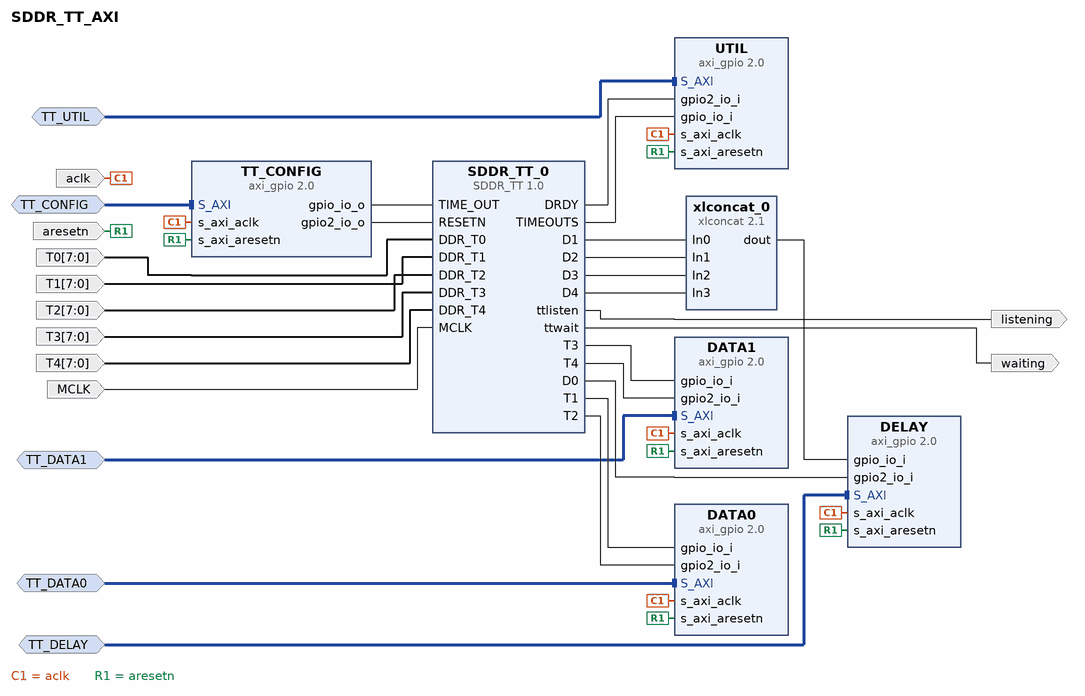
[diagram p0: block diagram of the top level]
# Vivado block design SDDR_TT_AXI, xc7z020clg400-1, Vivado 2019.1
create_bd_design SDDR_TT_AXI

create_bd_intf_port -mode Slave -vlnv xilinx.com:interface:aximm_tlm:1.0 TT_CONFIG
create_bd_intf_port -mode Slave -vlnv xilinx.com:interface:aximm_tlm:1.0 TT_DATA0
create_bd_intf_port -mode Slave -vlnv xilinx.com:interface:aximm_tlm:1.0 TT_DATA1
create_bd_intf_port -mode Slave -vlnv xilinx.com:interface:aximm_tlm:1.0 TT_DELAY
create_bd_intf_port -mode Slave -vlnv xilinx.com:interface:aximm_tlm:1.0 TT_UTIL
create_bd_port -dir I -from 7 -to 0 T0
create_bd_port -dir I -from 7 -to 0 T1
create_bd_port -dir I -from 7 -to 0 T2
create_bd_port -dir I -from 7 -to 0 T3
create_bd_port -dir I -from 7 -to 0 T4
create_bd_port -dir O waiting
create_bd_port -dir O listening
create_bd_port -dir I -type clk aclk
set_property -dict {CONFIG.FREQ_HZ 100000000} [get_bd_ports aclk]
create_bd_port -dir I -type rst aresetn
create_bd_port -dir I -type clk MCLK
set_property -dict {CONFIG.FREQ_HZ 400000000} [get_bd_ports MCLK]

create_bd_cell -type ip -vlnv xilinx.com:ip:axi_gpio:2.0 DATA0
set_property -dict {CONFIG.C_ALL_INPUTS 1 CONFIG.C_ALL_INPUTS_2 1 CONFIG.C_IS_DUAL 1} [get_bd_cells DATA0]
create_bd_cell -type ip -vlnv xilinx.com:ip:axi_gpio:2.0 DATA1
set_property -dict {CONFIG.C_ALL_INPUTS 1 CONFIG.C_ALL_INPUTS_2 1 CONFIG.C_IS_DUAL 1} [get_bd_cells DATA1]
create_bd_cell -type ip -vlnv xilinx.com:ip:axi_gpio:2.0 DELAY
set_property -dict {CONFIG.C_ALL_INPUTS 1 CONFIG.C_ALL_INPUTS_2 1 CONFIG.C_GPIO2_WIDTH 8 CONFIG.C_IS_DUAL 1} [get_bd_cells DELAY]
create_bd_cell -type ip -vlnv xilinx.com:ip:xlconcat:2.1 xlconcat_0
set_property -dict {CONFIG.NUM_PORTS 4} [get_bd_cells xlconcat_0]
create_bd_cell -type ip -vlnv xilinx.com:ip:axi_gpio:2.0 TT_CONFIG
set_property -dict [list \
  CONFIG.C_ALL_OUTPUTS 1 \
  CONFIG.C_ALL_OUTPUTS_2 1 \
  CONFIG.C_GPIO2_WIDTH 1 \
  CONFIG.C_IS_DUAL 1 \
] [get_bd_cells TT_CONFIG]
create_bd_cell -type ip -vlnv xilinx.com:ip:axi_gpio:2.0 UTIL
set_property -dict [list \
  CONFIG.C_ALL_INPUTS 1 \
  CONFIG.C_ALL_INPUTS_2 1 \
  CONFIG.C_GPIO2_WIDTH 1 \
  CONFIG.C_GPIO_WIDTH 4 \
  CONFIG.C_IS_DUAL 1 \
] [get_bd_cells UTIL]
create_bd_cell -type ip -vlnv cri.nz:user:SDDR_TT:1.0 SDDR_TT_0
set_property -dict {CONFIG.SIG_WIDTH 8} [get_bd_cells SDDR_TT_0]

# ---- connections ----

connect_bd_intf_net [get_bd_intf_ports TT_CONFIG] [get_bd_intf_pins TT_CONFIG/S_AXI]
connect_bd_intf_net [get_bd_intf_ports TT_UTIL] [get_bd_intf_pins UTIL/S_AXI]
connect_bd_intf_net -intf_net TT_DATA0_1 [get_bd_intf_ports TT_DATA0] [get_bd_intf_pins DATA0/S_AXI]
connect_bd_intf_net -intf_net TT_DATA1_1 [get_bd_intf_ports TT_DATA1] [get_bd_intf_pins DATA1/S_AXI]
connect_bd_intf_net [get_bd_intf_ports TT_DELAY] [get_bd_intf_pins DELAY/S_AXI]
connect_bd_net -net T0_1 [get_bd_ports T0] [get_bd_pins SDDR_TT_0/DDR_T0]
connect_bd_net -net T1_1 [get_bd_ports T1] [get_bd_pins SDDR_TT_0/DDR_T1]
connect_bd_net -net T2_1 [get_bd_ports T2] [get_bd_pins SDDR_TT_0/DDR_T2]
connect_bd_net -net T3_1 [get_bd_ports T3] [get_bd_pins SDDR_TT_0/DDR_T3]
connect_bd_net -net T4_1 [get_bd_ports T4] [get_bd_pins SDDR_TT_0/DDR_T4]
connect_bd_net [get_bd_pins SDDR_TT_0/T1] [get_bd_pins DATA0/gpio_io_i]
connect_bd_net [get_bd_pins SDDR_TT_0/T2] [get_bd_pins DATA0/gpio2_io_i]
connect_bd_net [get_bd_pins SDDR_TT_0/T3] [get_bd_pins DATA1/gpio_io_i]
connect_bd_net [get_bd_pins SDDR_TT_0/T4] [get_bd_pins DATA1/gpio2_io_i]
connect_bd_net [get_bd_pins SDDR_TT_0/D1] [get_bd_pins xlconcat_0/In0]
connect_bd_net [get_bd_pins SDDR_TT_0/D2] [get_bd_pins xlconcat_0/In1]
connect_bd_net [get_bd_pins SDDR_TT_0/D3] [get_bd_pins xlconcat_0/In2]
connect_bd_net [get_bd_pins SDDR_TT_0/D4] [get_bd_pins xlconcat_0/In3]
connect_bd_net [get_bd_pins xlconcat_0/dout] [get_bd_pins DELAY/gpio_io_i]
connect_bd_net [get_bd_pins SDDR_TT_0/D0] [get_bd_pins DELAY/gpio2_io_i]
connect_bd_net [get_bd_pins TT_CONFIG/gpio_io_o] [get_bd_pins SDDR_TT_0/TIME_OUT]
connect_bd_net [get_bd_pins TT_CONFIG/gpio2_io_o] [get_bd_pins SDDR_TT_0/RESETN]
connect_bd_net [get_bd_pins SDDR_TT_0/DRDY] [get_bd_pins UTIL/gpio2_io_i]
connect_bd_net [get_bd_pins SDDR_TT_0/TIMEOUTS] [get_bd_pins UTIL/gpio_io_i]
connect_bd_net [get_bd_pins SDDR_TT_0/ttlisten] [get_bd_ports listening]
connect_bd_net [get_bd_pins SDDR_TT_0/ttwait] [get_bd_ports waiting]
connect_bd_net [get_bd_ports aclk] \
  [get_bd_pins DELAY/s_axi_aclk] [get_bd_pins UTIL/s_axi_aclk] [get_bd_pins DATA1/s_axi_aclk] [get_bd_pins DATA0/s_axi_aclk] \
  [get_bd_pins TT_CONFIG/s_axi_aclk]
connect_bd_net [get_bd_ports aresetn] \
  [get_bd_pins DELAY/s_axi_aresetn] [get_bd_pins UTIL/s_axi_aresetn] [get_bd_pins DATA1/s_axi_aresetn] \
  [get_bd_pins DATA0/s_axi_aresetn] [get_bd_pins TT_CONFIG/s_axi_aresetn]
connect_bd_net [get_bd_ports MCLK] [get_bd_pins SDDR_TT_0/MCLK]

validate_bd_design
save_bd_design
